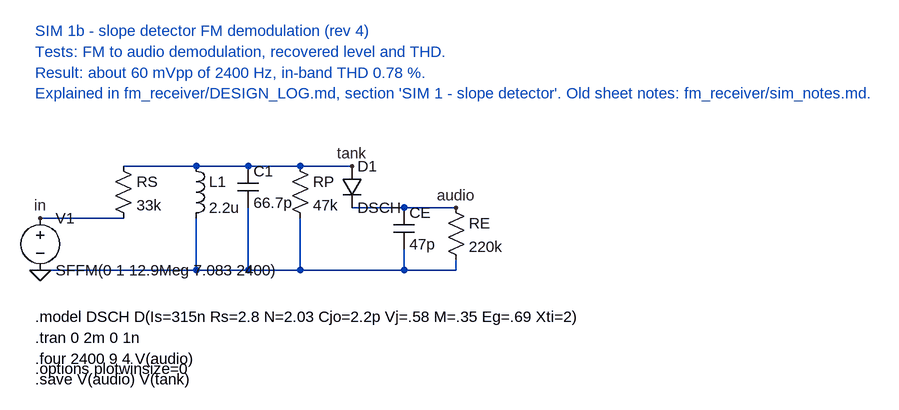
[diagram p0: schematic sim1b_slope_demod.asc]
sim1b_slope_demod.asc, the LTspice schematic file:
Version 4
SHEET 1 1200 680
WIRE 208 112 80 112
WIRE 320 32 208 32
WIRE 400 32 320 32
WIRE 480 32 400 32
WIRE 560 32 480 32
WIRE 640 96 560 96
WIRE 720 96 640 96
WIRE 320 192 320 112
WIRE 400 192 400 96
WIRE 480 192 480 112
WIRE 640 192 640 160
WIRE 720 192 720 176
WIRE 320 192 80 192
WIRE 400 192 320 192
WIRE 480 192 400 192
WIRE 640 192 480 192
WIRE 720 192 640 192
FLAG 80 192 0
FLAG 80 112 in
FLAG 560 32 tank
FLAG 720 96 audio
SYMBOL voltage 80 96 R0
SYMATTR InstName V1
SYMATTR Value SFFM(0 1 12.9Meg 7.083 2400)
SYMBOL res 192 16 R0
SYMATTR InstName RS
SYMATTR Value 33k
SYMBOL ind 304 16 R0
SYMATTR InstName L1
SYMATTR Value 2.2u
SYMBOL cap 384 32 R0
SYMATTR InstName C1
SYMATTR Value 66.7p
SYMBOL res 464 16 R0
SYMATTR InstName RP
SYMATTR Value 47k
SYMBOL diode 544 32 R0
SYMATTR InstName D1
SYMATTR Value DSCH
SYMBOL cap 624 96 R0
SYMATTR InstName CE
SYMATTR Value 47p
SYMBOL res 704 80 R0
SYMATTR InstName RE
SYMATTR Value 220k
TEXT 72 264 Left 2 !.model DSCH D(Is=315n Rs=2.8 N=2.03 Cjo=2.2p Vj=.58 M=.35 Eg=.69 Xti=2)
TEXT 72 296 Left 2 !.tran 0 2m 0 1n
TEXT 72 328 Left 2 !.four 2400 9 4 V(audio)
TEXT 72 344 Left 2 !.options plotwinsize=0
TEXT 72 360 Left 2 !.save V(audio) V(tank)
TEXT 72 -176 Left 2 ;SIM 1b - slope detector FM demodulation (rev 4)
TEXT 72 -144 Left 2 ;Tests: FM to audio demodulation, recovered level and THD.
TEXT 72 -112 Left 2 ;Result: about 60 mVpp of 2400 Hz, in-band THD 0.78 %.
TEXT 72 -80 Left 2 ;Explained in fm_receiver/DESIGN_LOG.md, section 'SIM 1 - slope detector'. Old sheet notes: fm_receiver/sim_notes.md.

The netlist it stands for:
* sim1b_slope_demod.asc
V1 in 0 SFFM(0 1 12.9Meg 7.083 2400)
RS tank in 33k
L1 tank 0 2.2u
C1 tank 0 66.7p
RP tank 0 47k
D1 tank audio DSCH
CE audio 0 47p
RE audio 0 220k
.model D D
.lib standard.dio
.model DSCH D(Is=315n Rs=2.8 N=2.03 Cjo=2.2p Vj=.58 M=.35 Eg=.69 Xti=2)
.tran 0 2m 0 1n
.four 2400 9 4 V(audio)
.options plotwinsize=0
.save V(audio) V(tank)
* SIM 1b - slope detector FM demodulation (rev 4)
* Tests: FM to audio demodulation, recovered level and THD.
* Result: about 60 mVpp of 2400 Hz, in-band THD 0.78 %.
* Explained in fm_receiver/DESIGN_LOG.md, section 'SIM 1 - slope detector'. Old sheet notes: fm_receiver/sim_notes.md.
.backanno
.end